# EAGLE design satshakit-mega (EAGLE 8.5.0)

## Sheet 1 of 2
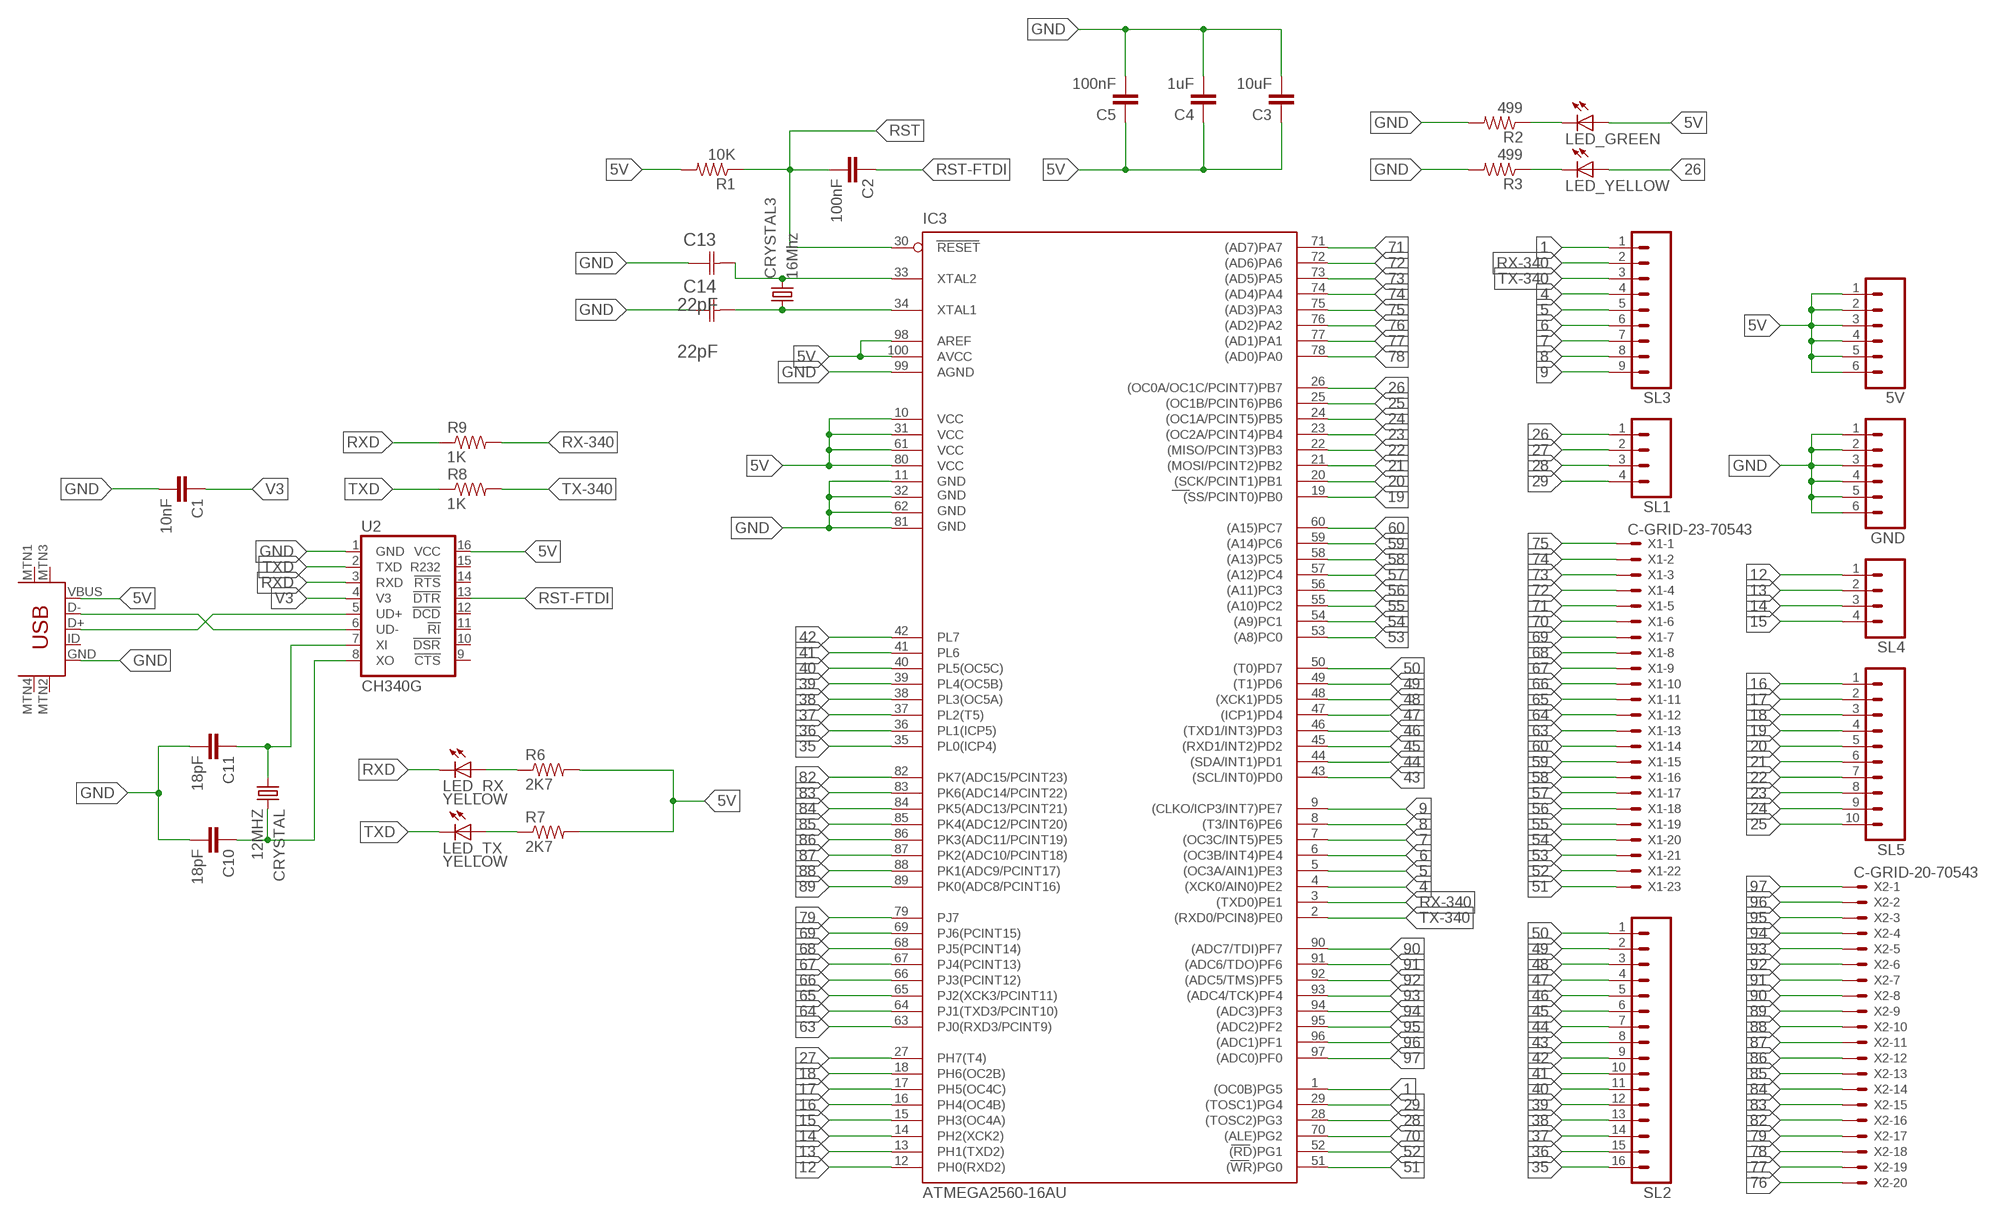
[diagram p0: schematic, sheet 1]

### Parts
5V  M06  [06P]
C1  10nF  CAP1206  [1206]
C2  100nF  CAP1206  [1206]
C3  10uF  CAP1206  [1206]
C4  1uF  CAP1206  [1206]
C5  100nF  CAP1206  [1206]
C10  18pF  CAP1206  [1206]
C11  18pF  CAP1206  [1206]
C13  22pF  0612ZC225MAT2A  [CAPC3216X178N]
C14  22pF  0612ZC225MAT2A  [CAPC3216X178N]
CRYSTAL  12MHZ  CSM-7X-DU  [CSM-7X-DU]
CRYSTAL3  16Mhz  CSM-7X-DU  [CSM-7X-DU]
GND  M06  [06P]
IC3  ATMEGA2560-16AU  ATMEGA1280-16AU  [TQFP100]
LED_GREEN  LED1206  [1206]
LED_RX  YELLOW  LED  [LED1206]
LED_TX  YELLOW  LED  [LED1206]
LED_YELLOW  LED1206  [1206]
R1  10K  RES-US1206  [R1206]
R2  499  RESISTOR1206  [1206]
R3  499  RESISTOR1206  [1206]
R6  2K7  RES-US1206  [R1206]
R7  2K7  RES-US1206  [R1206]
R8  1K  RES-US1206  [R1206]
R9  1K  RES-US1206  [R1206]
SL1  M04  [04P]
SL2  M16  [16P]
SL3  M09  [09P]
SL4  M04  [04P]
SL5  M10  [10P]
U2  CH340G  CH340GSMD  [SO016]
U$7  USB-MINIB-5PIN  [USB-MINIB]
X1  C-GRID-23-70543  [70543-23]
X2  C-GRID-20-70543  [70543-20]

### Nets
1: IC3.1((OC0B)PG5) SL3.1
4: IC3.4((XCK0/AIN0)PE2) SL3.4
5: IC3.5((OC3A/AIN1)PE3) SL3.5
5V: 5V.1 5V.2 5V.3 5V.4 5V.5 5V.6 C3.1 C4.1 C5.1 IC3.10(VCC) IC3.31(VCC1) IC3.61(VCC2) IC3.80(VCC3) IC3.98(AREF) IC3.100(AVCC) LED_GREEN.1(A) R1.2 R6.2 R7.2 U2.16(VCC) U$7.VBUS
6: IC3.6((OC3B/INT4)PE4) SL3.6
7: IC3.7((OC3C/INT5)PE5) SL3.7
8: IC3.8((T3/INT6)PE6) SL3.8
9: IC3.9((CLKO/ICP3/INT7)PE7) SL3.9
12: IC3.12(PH0(RXD2)) SL4.1
13: IC3.13(PH1(TXD2)) SL4.2
14: IC3.14(PH2(XCK2)) SL4.3
15: IC3.15(PH3(OC4A)) SL4.4
16: IC3.16(PH4(OC4B)) SL5.1
17: IC3.17(PH5(OC4C)) SL5.2
18: IC3.18(PH6(OC2B)) SL5.3
19: IC3.19((SS/PCINT0)PB0) SL5.4
20: IC3.20((SCK/PCINT1)PB1) SL5.5
21: IC3.21((MOSI/PCINT2)PB2) SL5.6
22: IC3.22((MISO/PCINT3)PB3) SL5.7
23: IC3.23((OC2A/PCINT4)PB4) SL5.8
24: IC3.24((OC1A/PCINT5)PB5) SL5.9
25: IC3.25((OC1B/PCINT6)PB6) SL5.10
26: IC3.26((OC0A/OC1C/PCINT7)PB7) LED_YELLOW.1(A) SL1.1
27: IC3.27(PH7(T4)) SL1.2
28: IC3.28((TOSC2)PG3) SL1.3
29: IC3.29((TOSC1)PG4) SL1.4
35: IC3.35(PL0(ICP4)) SL2.16
36: IC3.36(PL1(ICP5)) SL2.15
37: IC3.37(PL2(T5)) SL2.14
38: IC3.38(PL3(OC5A)) SL2.13
39: IC3.39(PL4(OC5B)) SL2.12
40: IC3.40(PL5(OC5C)) SL2.11
41: IC3.41(PL6) SL2.10
42: IC3.42(PL7) SL2.9
43: IC3.43((SCL/INT0)PD0) SL2.8
44: IC3.44((SDA/INT1)PD1) SL2.7
45: IC3.45((RXD1/INT2)PD2) SL2.6
46: IC3.46((TXD1/INT3)PD3) SL2.5
47: IC3.47((ICP1)PD4) SL2.4
48: IC3.48((XCK1)PD5) SL2.3
49: IC3.49((T1)PD6) SL2.2
50: IC3.50((T0)PD7) SL2.1
51: IC3.51((WR)PG0) X1.23
52: IC3.52((RD)PG1) X1.22
53: IC3.53((A8)PC0) X1.21
54: IC3.54((A9)PC1) X1.20
55: IC3.55((A10)PC2) X1.19
56: IC3.56((A11)PC3) X1.18
57: IC3.57((A12)PC4) X1.17
58: IC3.58((A13)PC5) X1.16
59: IC3.59((A14)PC6) X1.15
60: IC3.60((A15)PC7) X1.14
63: IC3.63(PJ0(RXD3/PCINT9)) X1.13
64: IC3.64(PJ1(TXD3/PCINT10)) X1.12
65: IC3.65(PJ2(XCK3/PCINT11)) X1.11
66: IC3.66(PJ3(PCINT12)) X1.10
67: IC3.67(PJ4(PCINT13)) X1.9
68: IC3.68(PJ5(PCINT14)) X1.8
69: IC3.69(PJ6(PCINT15)) X1.7
70: IC3.70((ALE)PG2) X1.6
71: IC3.71((AD7)PA7) X1.5
72: IC3.72((AD6)PA6) X1.4
73: IC3.73((AD5)PA5) X1.3
74: IC3.74((AD4)PA4) X1.2
75: IC3.75((AD3)PA3) X1.1
76: IC3.76((AD2)PA2) X2.20
77: IC3.77((AD1)PA1) X2.19
78: IC3.78((AD0)PA0) X2.18
79: IC3.79(PJ7) X2.17
82: IC3.82(PK7(ADC15/PCINT23)) X2.16
83: IC3.83(PK6(ADC14/PCINT22)) X2.15
84: IC3.84(PK5(ADC13/PCINT21)) X2.14
85: IC3.85(PK4(ADC12/PCINT20)) X2.13
86: IC3.86(PK3(ADC11/PCINT19)) X2.12
87: IC3.87(PK2(ADC10/PCINT18)) X2.11
88: IC3.88(PK1(ADC9/PCINT17)) X2.10
89: IC3.89(PK0(ADC8/PCINT16)) X2.9
90: IC3.90((ADC7/TDI)PF7) X2.8
91: IC3.91((ADC6/TDO)PF6) X2.7
92: IC3.92((ADC5/TMS)PF5) X2.6
93: IC3.93((ADC4/TCK)PF4) X2.5
94: IC3.94((ADC3)PF3) X2.4
95: IC3.95((ADC2)PF2) X2.3
96: IC3.96((ADC1)PF1) X2.2
97: IC3.97((ADC0)PF0) X2.1
GND: C1.2 C3.2 C4.2 C5.2 C10.2 C11.2 C13.1(C1) C14.1(C1) GND.1 GND.2 GND.3 GND.4 GND.5 GND.6 IC3.11(GND) IC3.32(GND1) IC3.62(GND2) IC3.81(GND3) IC3.99(AGND) R2.2 R3.2 U2.1(GND) U$7.GND
N$1: U2.5(UD+) U$7.D+
N$2: LED_RX.1(A) R6.1
N$3: U2.6(UD-) U$7.D-
N$4: C14.2(C2) CRYSTAL3.1 IC3.34(XTAL1)
N$5: C13.2(C2) CRYSTAL3.2 IC3.33(XTAL2)
N$6: LED_YELLOW.2(C) R3.1
N$8: LED_TX.1(A) R7.1
N$26: LED_GREEN.2(C) R2.1
OSC_IN: C10.1 CRYSTAL.2 U2.8(XO)
OSC_OUT: C11.1 CRYSTAL.1 U2.7(XI)
RST: C2.2 IC3.30(RESET) R1.1
RST-FTDI: C2.1 U2.13(!DTR)
RX-340: IC3.3((TXD0)PE1) R9.2 SL3.2
RXD: LED_RX.2(C) R9.1 U2.3(RXD)
TX-340: IC3.2((RXD0/PCIN8)PE0) R8.2 SL3.3
TXD: LED_TX.2(C) R8.1 U2.2(TXD)
V3: C1.1 U2.4(V3)
Unconnected: U2.9(!CTS) U2.10(!DSR) U2.11(!RI) U2.12(!DCD) U2.14(!RTS) U2.15(R232) U$7.ID U$7.MTN1(MTN2) U$7.MTN2(MTN3) U$7.MTN3(MTN1) U$7.MTN4

## Sheet 2 of 2

## Library data of the parts
5V GND = con-amp-quick:M06: AMP QUICK CONNECTOR; OC_FARNELL: unknown; OC_NEWARK: unknown
C1-C5 C10 C11 = 01_SparkFun:CAP: Capacitor Standard 0603 ceramic capacitor, and 0.1" leaded capacitor.
C13 C14 = AVX_By_element14_Batch_1:0612ZC225MAT2A: Capacitor 1206; MPN: 0612ZC225MAT2A; OC_FARNELL: -; OC_NEWARK: 12N3209; SUPPLIER: AVX; TOLERANCE: ±20%; VALUE: 2.2µF; VOLTAGERATING: 10V
CRYSTAL = flight_controller.lbr01_FAB_Hello:CSM-7X-DU: SMD CRYSTAL Source: www.ecsxtal.com .. Crystal 3.6864MHz CSM_7X_DU.PDF; OC_FARNELL: unknown; OC_NEWARK: unknown
CRYSTAL3 = 01_FAB_Hello:CSM-7X-DU: SMD CRYSTAL Source: www.ecsxtal.com .. Crystal 3.6864MHz CSM_7X_DU.PDF; OC_FARNELL: unknown; OC_NEWARK: unknown
IC3 = atmel-2005:ATMEGA*: MICROCONTROLLER 64/128/256 Kbytes FLASH 4 Kbytes EEPROM 8 Kbytes SRAM 86 General Purpose I/O pins 12-channels16-bit PWM 4 x Serial USARTs 16-channels 10-bit A/D
LED_GREEN LED_YELLOW = 01_FAB_Hello:LED
LED_RX LED_TX = fab:LED: LED
R1 R6-R9 = fab:RES-US: Resistor (US Symbol) Variants with postfix FAB are widened to allow the routing of internal traces
R2 R3 = 01_SparkFun:RESISTOR: Resistor Basic schematic elements and footprints for 0603, 1206, and PTH 1/10th watt (small) resistors.
SL1 SL4 = con-amp-quick:M04: AMP QUICK CONNECTOR; OC_FARNELL: unknown; OC_NEWARK: unknown
SL2 = con-amp-quick:M16: AMP QUICK CONNECTOR; OC_FARNELL: unknown; OC_NEWARK: unknown
SL3 = con-amp-quick:M09: AMP QUICK CONNECTOR; OC_FARNELL: unknown; OC_NEWARK: unknown
SL5 = con-amp-quick:M10: AMP QUICK CONNECTOR; OC_FARNELL: unknown; OC_NEWARK: unknown
U2 = SparkFun-DigitalIC:CH340G: A simple USB 2.0 to Serial IC.; PROD_ID: IC-13498
U$7 = SparkFun:USB-MINIB
X1 = con-molex:C-GRID-23: CONNECTOR wire to board 2.54 mm (0.100") pitch header; OC_FARNELL: unknown; OC_NEWARK: unknown
X2 = con-molex:C-GRID-20: CONNECTOR wire to board 2.54 mm (0.100") pitch header; OC_FARNELL: unknown; OC_NEWARK: unknown

## Board
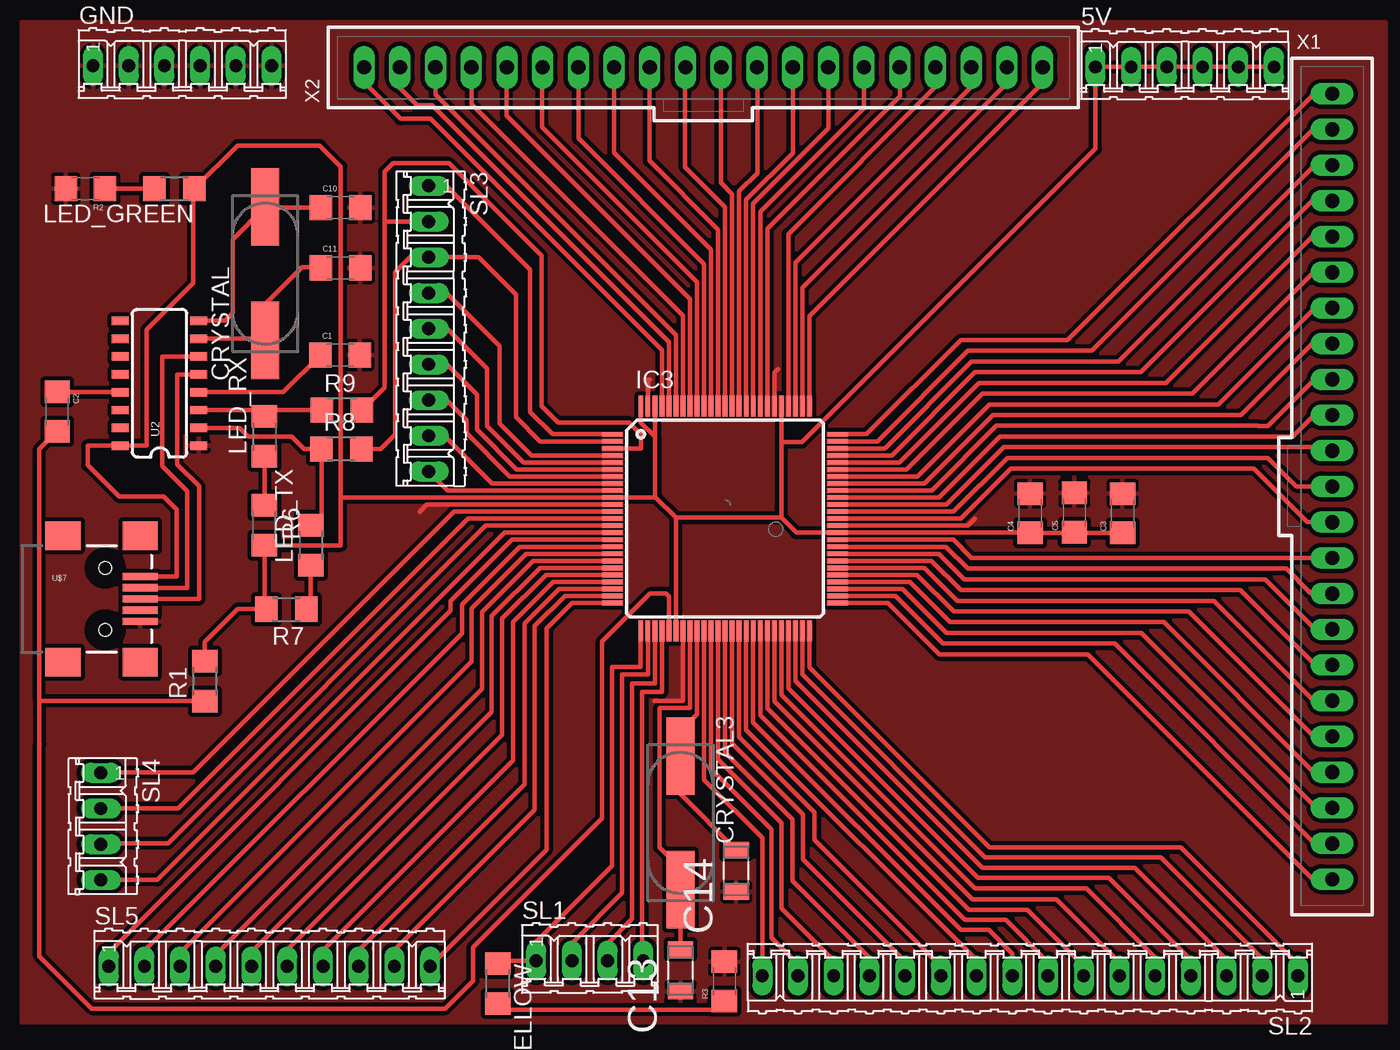
[diagram p1: board, top side]

No outline drawn. Coordinates in mm, seen from the top.
Copper layers (1*16): Top 0.035mm / dielectric 1.5mm / Bottom 0.035mm
Design rules "default": minimum track width 10mil, minimum drill 24mil, track to track 8mil, track to pad 8mil, pad to pad 8mil, via to via 8mil, smd to smd 8mil, copper to edge 40mil, drill to drill 8mil, minimum pad ring 10mil, minimum via ring 8mil, stop-mask expansion 4mil, vias tented up to drill 0mil, thermal gap 10mil

### Footprints (pad centres in the part's own frame; a part is rotated, then mirrored left to right if it is on the bottom)
06P = drill 0.914 long: 1 -6.35,0; 2 -3.81,0; 3 -1.27,0; 4 1.27,0; 5 3.81,0; 6 6.35,0
1206 = smd 1.6 x 1.8: 1 -1.4,0; 2 1.4,0
CAPC3216X178N = smd 1.118 x 1.803: 1 -1.499,0; 2 1.499,0
CSM-7X-DU = smd 5.5 x 2: 1 -4.75,0; 2 4.75,0
TQFP100 = smd 1.5 x 0.35: 1 -8,6; 2 -8,5.5; 3 -8,5; 4 -8,4.5; 5 -8,4; 6 -8,3.5; 7 -8,3; 8 -8,2.5; 9 -8,2; 10 -8,1.5; 11 -8,1; 12 -8,0.5; 13 -8,0; 14 -8,-0.5; 15 -8,-1; 16 -8,-1.5; 17 -8,-2; 18 -8,-2.5; 19 -8,-3; 20 -8,-3.5; 21 -8,-4; 22 -8,-4.5; 23 -8,-5; 24 -8,-5.5; 25 -8,-6; 51 8,-6; 52 8,-5.5; 53 8,-5; 54 8,-4.5; 55 8,-4; 56 8,-3.5; 57 8,-3; 58 8,-2.5; 59 8,-2; 60 8,-1.5; 61 8,-1; 62 8,-0.5; 63 8,0; 64 8,0.5; 65 8,1; 66 8,1.5; 67 8,2; 68 8,2.5; 69 8,3; 70 8,3.5; 71 8,4; 72 8,4.5; 73 8,5; 74 8,5.5; 75 8,6 | smd 0.35 x 1.5: 26 -6,-8; 27 -5.5,-8; 28 -5,-8; 29 -4.5,-8; 30 -4,-8; 31 -3.5,-8; 32 -3,-8; 33 -2.5,-8; 34 -2,-8; 35 -1.5,-8; 36 -1,-8; 37 -0.5,-8; 38 0,-8; 39 0.5,-8; 40 1,-8; 41 1.5,-8; 42 2,-8; 43 2.5,-8; 44 3,-8; 45 3.5,-8; 46 4,-8; 47 4.5,-8; 48 5,-8; 49 5.5,-8; 50 6,-8; 76 6,8; 77 5.5,8; 78 5,8; 79 4.5,8; 80 4,8; 81 3.5,8; 82 3,8; 83 2.5,8; 84 2,8; 85 1.5,8; 86 1,8; 87 0.5,8; 88 0,8; 89 -0.5,8; 90 -1,8; 91 -1.5,8; 92 -2,8; 93 -2.5,8; 94 -3,8; 95 -3.5,8; 96 -4,8; 97 -4.5,8; 98 -5,8; 99 -5.5,8; 100 -6,8
1206' = smd 1.6 x 1.803: 1 -1.422,0; 2 1.422,0
LED1206 = smd 1.6 x 1.803: 1 -1.422,0; 2 1.422,0
R1206 = smd 1.6 x 1.803: 1 -1.422,0; 2 1.422,0
04P = drill 0.914 long: 1 -3.81,0; 2 -1.27,0; 3 1.27,0; 4 3.81,0
16P = drill 0.914 long: 1 -19.05,0; 2 -16.51,0; 3 -13.97,0; 4 -11.43,0; 5 -8.89,0; 6 -6.35,0; 7 -3.81,0; 8 -1.27,0; 9 1.27,0; 10 3.81,0; 11 6.35,0; 12 8.89,0; 13 11.43,0; 14 13.97,0; 15 16.51,0; 16 19.05,0
09P = drill 0.914 long: 1 -10.16,0; 2 -7.62,0; 3 -5.08,0; 4 -2.54,0; 5 0,0; 6 2.54,0; 7 5.08,0; 8 7.62,0; 9 10.16,0
10P = drill 0.914 long: 1 -11.43,0; 2 -8.89,0; 3 -6.35,0; 4 -3.81,0; 5 -1.27,0; 6 1.27,0; 7 3.81,0; 8 6.35,0; 9 8.89,0; 10 11.43,0
SO016 = smd 0.6 x 1.2: 1 -4.445,-2.8; 2 -3.175,-2.8; 3 -1.905,-2.8; 4 -0.635,-2.8; 5 0.635,-2.8; 6 1.905,-2.8; 7 3.175,-2.8; 8 4.445,-2.8; 9 4.445,2.8; 10 3.175,2.8; 11 1.905,2.8; 12 0.635,2.8; 13 -0.635,2.8; 14 -1.905,2.8; 15 -3.175,2.8; 16 -4.445,2.8
USB-MINIB = smd 2.5 x 0.5: D+ 2.5,0; D- 2.5,0.8; GND 2.5,-1.6; ID 2.5,-0.8; VBUS 2.5,1.6 | smd 2.5 x 2: MTN1 -3,4.5; MTN2 2.5,4.5; MTN3 -3,-4.5; MTN4 2.5,-4.5 | hole 0.9: 0,2.2; 0,-2.2
70543-23 = drill 1.016 long: 1 -27.94,0; 2 -25.4,0; 3 -22.86,0; 4 -20.32,0; 5 -17.78,0; 6 -15.24,0; 7 -12.7,0; 8 -10.16,0; 9 -7.62,0; 10 -5.08,0; 11 -2.54,0; 12 0,0; 13 2.54,0; 14 5.08,0; 15 7.62,0; 16 10.16,0; 17 12.7,0; 18 15.24,0; 19 17.78,0; 20 20.32,0; 21 22.86,0; 22 25.4,0; 23 27.94,0
70543-20 = drill 1.016 long: 1 -24.13,0; 2 -21.59,0; 3 -19.05,0; 4 -16.51,0; 5 -13.97,0; 6 -11.43,0; 7 -8.89,0; 8 -6.35,0; 9 -3.81,0; 10 -1.27,0; 11 1.27,0; 12 3.81,0; 13 6.35,0; 14 8.89,0; 15 11.43,0; 16 13.97,0; 17 16.51,0; 18 19.05,0; 19 21.59,0; 20 24.13,0

### Placement (x,y rotation side)
5V  108.89,90.81 0 top
C1  48.82,70.31 0 top
C2  28.7,66.29 270 top
C3  104.47,59.05 90 top
C4  97.89,59.05 90 top
C5  101.04,59.11 90 top
C10  48.84,80.8 0 top
C11  48.84,76.5 0 top
C13  73.03,26.54 90 top
C14  76.99,33.63 90 top
CRYSTAL  43.48,76.1 90 top
CRYSTAL3  73.03,37.03 270 top
GND  37.59,90.88 0 top
IC3  76.2,58.67 0 top
LED_GREEN  [1206']  37.03,82.14 180 top
LED_RX  43.43,64.52 90 top
LED_TX  46.74,56.79 90 top
LED_YELLOW  [1206']  60.05,25.6 270 top
R1  39.19,47.12 90 top
R2  30.71,82.14 180 top
R3  76.15,25.76 90 top
R6  43.43,58.19 270 top
R7  44.98,52.22 180 top
R8  48.92,63.63 0 top
R9  48.95,66.4 0 top
SL1  66.57,27.23 0 top
SL2  97.89,26.16 180 top
SL3  55.12,72.19 270 top
SL4  31.8,36.78 270 top
SL5  43.79,26.82 0 top
U2  35.97,68.3 90 top
U$7  32.11,52.96 0 top
X1  119.38,60.96 270 top
X2  74.65,90.78 0 top

### Tracks (layer width: path | path; a pad name or v marks a point on that pad's centre or on a via)
1
  Top 0.305: IC3.1 63.93,64.67 62.33,66.27 62.33,76.38 56.36,82.35 SL3.1
4
  Top 0.305: IC3.4 62.43,63.17 60.17,65.43 60.17,70.94 56.39,74.73 SL3.4
5
  Top 0.305: IC3.5 61.86,62.67 59.28,65.25 59.28,69.34 56.44,72.19 SL3.5
5V
  Top 0.305: 80.2,58.74 80.2,64.11 | 80.2,64.11 IC3.80 | 80.2,58.74 81.26,57.67 IC3.61 97.87,57.67 C4.1 100.99,57.66 C5.1 101.09,57.66 C3.1 | IC3.31 72.7,58.74 | 72.7,58.74 80.2,58.74 | 71.12,60.17 IC3.10 | 71.12,60.17 71.26,60.17 72.7,58.74 | 71.2,64.52 IC3.98 | 71.2,64.52 71.2,60.25 71.12,60.17 | IC3.10 68.18,60.2 | 43.43,52.35 R6.2 48.87,56.77 48.87,60.17 | 43.43,52.35 R7.2 | 43.43,52.35 43.33,52.25 41.53,52.25 39.19,49.91 R1.2 | IC3.10 48.87,60.17 | U$7.VBUS 37.21,54.56 37.21,59.31 36.27,60.25 33.1,60.25 30.86,62.48 30.86,63.86 U2.16 35.08,63.86 35.08,72.11 38.38,75.41 38.38,82.07 LED_GREEN.1 | IC3.100 70.2,65.52 71.2,64.52 | LED_GREEN.1 41.53,85.22 47.37,85.22 48.87,83.72 48.87,60.17 | 38.45,81.61 LED_GREEN.1 | 80.2,64.11 81.66,64.11 102.54,84.99 5V.1 5V.2 5V.3 5V.4 5V.5 5V.6
6
  Top 0.305: IC3.6 61.37,62.17 58.55,65 58.55,67.51 56.39,69.67 55.14,69.67 SL3.6
7
  Top 0.305: IC3.7 60.88,61.67 57.81,64.75 57.81,65.68 56.41,67.08 55.14,67.08 SL3.7
8
  Top 0.305: IC3.8 59.63,61.17 56.31,64.49 55.19,64.49 SL3.8
9
  Top 0.305: IC3.9 56.47,60.67 SL3.9
12
  Top 0.305: IC3.12 56.94,59.17 38.38,40.62 31.83,40.62 SL4.1
13
  Top 0.305: IC3.13 57.91,58.67 37.29,38.05 SL4.2
14
  Top 0.305: IC3.14 59.16,58.17 36.58,35.59 31.88,35.59 SL4.3
15
  Top 0.305: IC3.15 60.52,57.67 35.81,32.97 SL4.4
16
  Top 0.305: IC3.16 61.06,57.17 56.69,52.81 56.69,52.15 32.38,27.84 32.38,26.85 SL5.1
17
  Top 0.305: IC3.17 61.58,56.67 57.48,52.58 57.48,50.52 34.9,27.94 SL5.2
18
  Top 0.305: IC3.18 62.04,56.17 58.17,52.3 58.17,48.51 37.47,27.81 37.47,26.85 SL5.3
19
  Top 0.305: IC3.19 62.56,55.67 58.9,52.02 58.9,46.56 39.98,27.64 SL5.4
20
  Top 0.305: IC3.20 63.02,55.17 59.59,51.74 59.59,44.93 42.55,27.89 42.55,26.85 SL5.5
21
  Top 0.305: IC3.21 63.46,54.67 60.35,51.56 60.35,43.31 45.06,28.02 SL5.6
22
  Top 0.305: IC3.22 63.98,54.17 61.11,51.31 61.11,41.48 47.57,27.94 47.57,26.85 SL5.7
23
  Top 0.305: IC3.23 64.39,53.67 61.92,51.21 61.92,39.78 50.16,28.02 50.16,26.85 SL5.8
24
  Top 0.305: IC3.24 64.81,53.17 62.66,51.03 62.66,37.95 52.7,27.99 52.7,26.85 SL5.9
25
  Top 0.305: IC3.25 65.32,52.67 63.5,50.85 63.5,35.1 SL5.10
26
  Top 0.305: IC3.26 70.2,48.11 68.17,48.11 68.17,33.98 62.76,28.57 SL1.1 60.25,27.23 LED_YELLOW.1
27
  Top 0.305: IC3.27 70.7,47.6 68.89,47.6 68.89,32.05 65.3,28.47 SL1.2
28
  Top 0.305: IC3.28 71.2,46.94 69.6,46.94 69.6,30.2 67.84,28.45 SL1.3
29
  Top 0.305: IC3.29 71.7,46.33 70.31,46.33 70.31,27.23 SL1.4
35
  Top 0.305: IC3.35 74.7,40.11 78.84,35.97 SL2.16
36
  Top 0.305: IC3.36 75.2,40.88 79.5,36.58 79.5,28.85 81.38,26.98 SL2.15
37
  Top 0.305: IC3.37 75.7,41.55 80.21,37.03 80.21,30.94 83.97,27.18 83.97,26.21 SL2.14
38
  Top 0.305: IC3.38 76.2,42.06 80.97,37.29 80.97,32.92 86.46,27.43 SL2.13
39
  Top 0.305: IC3.39 76.7,42.68 81.74,37.64 81.74,34.44 89,27.18 SL2.12
40
  Top 0.305: IC3.40 77.2,43.15 82.55,37.8 82.55,35.81 91.54,26.82 SL2.11
41
  Top 0.305: IC3.41 77.7,43.66 94.08,27.28 SL2.10
42
  Top 0.305: IC3.42 78.2,44.18 92.96,29.41 94.94,29.41 96.62,27.74 SL2.9
43
  Top 0.305: IC3.43 78.7,44.69 93.27,30.12 96.16,30.12 99.16,27.13 SL2.8
44
  Top 0.305: IC3.44 79.2,45.16 93.52,30.84 97.69,30.84 101.7,26.82 SL2.7
45
  Top 0.305: IC3.45 79.7,45.67 93.78,31.6 99.77,31.6 104.24,27.13 SL2.6
46
  Top 0.305: IC3.46 80.2,46.14 93.98,32.36 101.91,32.36 106.78,27.48 SL2.5
47
  Top 0.305: IC3.47 80.7,46.6 94.18,33.12 103.48,33.12 109.32,27.28 SL2.4
48
  Top 0.305: IC3.48 81.2,47.12 94.49,33.83 105.36,33.83 111.86,27.33 SL2.3
49
  Top 0.305: IC3.49 81.7,47.59 94.69,34.59 107.19,34.59 114.4,27.38 SL2.2
50
  Top 0.305: IC3.50 82.2,48.1 95,35.31 108.61,35.31 116.94,26.98 SL2.1
51
  Top 0.305: IC3.51 87.79,52.67 91.44,49.02 102.01,49.02 118.01,33.02 X1.23
52
  Top 0.305: IC3.52 88.3,53.17 91.69,49.78 103.91,49.78 118.11,35.59 119.36,35.59 X1.22
53
  Top 0.305: IC3.53 88.82,53.67 91.95,50.55 105.82,50.55 118.26,38.1 X1.21
54
  Top 0.305: IC3.54 89.34,54.17 92.2,51.31 107.42,51.31 118.08,40.64 X1.20
55
  Top 0.305: IC3.55 89.85,54.67 92.46,52.07 109.19,52.07 118.03,43.23 119.33,43.23 X1.19
56
  Top 0.305: IC3.56 90.37,55.17 92.71,52.83 110.95,52.83 118.08,45.7 119.36,45.7 X1.18
57
  Top 0.305: IC3.57 90.88,55.67 92.96,53.59 112.85,53.59 118.19,48.26 X1.17
58
  Top 0.305: IC3.58 91.4,56.17 93.22,54.36 114.61,54.36 118.14,50.83 119.36,50.83 X1.16
59
  Top 0.305: IC3.59 91.92,56.67 93.47,55.12 116.1,55.12 117.83,53.39 119.33,53.39 X1.15
60
  Top 0.305: IC3.60 92.43,57.17 93.73,55.88 X1.14
63
  Top 0.305: IC3.63 92.96,58.67 96.52,62.23 113.79,62.23 117.6,58.42 X1.13
64
  Top 0.305: IC3.64 92.45,59.17 96.27,62.99 114.81,62.99 116.84,60.96 X1.12
65
  Top 0.305: IC3.65 91.93,59.67 96.01,63.75 119.13,63.75 X1.11
66
  Top 0.305: IC3.66 91.42,60.17 95.76,64.52 116.59,64.52 118.11,66.04 X1.10
67
  Top 0.305: IC3.67 90.9,60.67 95.5,65.28 114.05,65.28 114.07,65.25 114.78,65.25 118.11,68.58 X1.9
68
  Top 0.305: IC3.68 90.38,61.17 95.25,66.04 112.88,66.04 117.98,71.14 119.36,71.14 X1.8
69
  Top 0.305: IC3.69 89.87,61.67 95,66.8 111.28,66.8 118.14,73.66 X1.7
70
  Top 0.305: IC3.70 89.1,62.17 94.49,67.56 109.42,67.56 118.06,76.2 X1.6
71
  Top 0.305: IC3.71 88.58,62.67 94.23,68.33 107.54,68.33 117.96,78.74 X1.5
72
  Top 0.305: IC3.72 88.07,63.17 93.98,69.09 105.77,69.09 117.93,81.25 119.36,81.25 X1.4
73
  Top 0.305: IC3.73 87.55,63.67 93.73,69.85 104.17,69.85 118.14,83.82 X1.3
74
  Top 0.305: IC3.74 87.03,64.17 93.47,70.61 102.29,70.61 118.01,86.33 119.36,86.33 X1.2
75
  Top 0.305: IC3.75 86.26,64.67 92.96,71.37 100.56,71.37 118.06,88.88 119.36,88.88 X1.1
76
  Top 0.305: IC3.76 82.2,73.08 98.81,89.69 98.81,90.75 X2.20
77
  Top 0.305: IC3.77 81.7,75.12 96.24,89.66 X2.19
78
  Top 0.305: IC3.78 81.2,76.88 93.73,89.41 93.73,90.75 X2.18
79
  Top 0.305: IC3.79 80.7,78.92 91.16,89.38 X2.17
82
  Top 0.305: IC3.82 79.2,79.3 88.62,88.72 X2.16
83
  Top 0.305: IC3.83 78.7,80.5 86.08,87.88 X2.15
84
  Top 0.305: IC3.84 78.2,81.07 83.57,86.44 83.57,90.75 X2.14
85
  Top 0.305: IC3.85 77.7,81.36 81.03,84.68 81.03,90.75 X2.13
86
  Top 0.305: IC3.86 77.2,81.97 78.49,83.26 78.49,90.75 X2.12
87
  Top 0.305: IC3.87 76.7,81.77 75.89,82.58 75.89,90.75 X2.11
88
  Top 0.305: IC3.88 76.2,80.82 73.36,83.67 73.36,90.75 X2.10
89
  Top 0.305: IC3.89 75.7,79.24 70.81,84.12 70.81,90.75 X2.9
90
  Top 0.305: IC3.90 75.2,77.81 68.3,84.71 X2.8
91
  Top 0.305: IC3.91 74.7,76.79 65.76,85.72 X2.7
92
  Top 0.305: IC3.92 74.2,75.51 63.2,86.51 63.2,90.75 X2.6
93
  Top 0.305: IC3.93 73.7,74.28 60.66,87.33 60.66,90.75 X2.5
94
  Top 0.305: IC3.94 73.2,73.1 58.17,88.14 58.17,90.75 X2.4
95
  Top 0.305: IC3.95 72.7,71.72 55.6,88.82 X2.3
96
  Top 0.305: IC3.96 72.2,71.23 55.35,88.09 54.3,88.09 53.06,89.33 53.06,89.81 | 53.06,89.81 53.06,89.31 | 53.06,89.81 X2.2
97
  Top 0.305: IC3.97 71.7,70.67 55.24,87.12 53.11,87.12 50.52,89.71 50.52,90.35 | 50.52,90.35 50.52,89.69 | 50.52,90.35 X2.1
GND
  Top 0.305: IC3.99 70.7,68.58 70.87,68.58 | 93.98,58.67 93.48,58.17 IC3.62 | 71.17,45.72 73.2,45.72 IC3.32 | 54.46,59.16 54.98,59.67 IC3.11 | IC3.81 79.7,69.06 79.96,69.32
  pour Top (isolate 0.305): 26.16,93.98 26.16,22.86 123.19,22.86 123.19,93.98
N$1
  Top 0.305: U$7.D+ 38.79,52.96 38.79,60.98 37.24,62.53 37.24,68.94 U2.5
N$2
  Top 0.305: LED_RX.1 R6.1
N$3
  Top 0.305: U$7.D- 37.95,53.76 37.95,60.63 36.17,62.41 36.17,70.21 U2.6
N$4
  Top 0.305: IC3.34 74.2,44.74 73.05,43.59 73.05,41.81 CRYSTAL3.1 73.03,39.09 C14.2
N$5
  Top 0.305: IC3.33 73.7,45.21 71.58,45.21 71.53,45.16 71.53,35.31 73.03,33.81 CRYSTAL3.2 | 73,33.88 73,32.31 CRYSTAL3.2 | CRYSTAL3.2 C13.2
N$6
  Top 0.305: 60.43,23.8 LED_YELLOW.2 60.48,23.75 75.56,23.75 75.56,23.77 R3.1
N$8
  Top 0.305: LED_TX.1 46.74,52.55 R7.1
N$26
  Top 0.305: R2.1 LED_GREEN.2
OSC_IN
  Top 0.305: U2.8 40.64,72.75 41.17,73.28 41.17,78.54 CRYSTAL.2 43.48,80.8 C10.1
OSC_OUT
  Top 0.305: U2.7 43.48,71.48 CRYSTAL.1 43.48,73.94 46.1,76.56 47.39,76.56 C11.1
RST
  Top 0.305: IC3.30 72.2,53.15 72.01,53.34 70.87,53.34 67.46,49.94 67.46,37.36 58.27,28.17 58.27,25.81 56.29,23.82 31.17,23.82 27.43,27.56 27.43,42.62 | 27.46,42.65 27.43,42.62 | 27.43,45.8 27.43,42.62 | 27.43,45.8 27.43,63.62 C2.2 | R1.1 27.53,45.7 27.43,45.8
RST-FTDI
  Top 0.305: C2.1 33.14,67.69 U2.13
RX-340
  Top 0.305: R9.2 51.97,68 51.97,79.78 | 55.09,79.83 SL3.2 51.99,79.81 51.97,79.78 | 51.97,79.78 51.97,83.34 52.58,83.95 56.57,83.95 63.14,77.37 63.14,66.67 64.31,65.51 69.37,65.51 70.21,64.67 70.21,63.67 IC3.3
RXD
  Top 0.305: 44.07,66.4 U2.3 | 44.07,66.4 R9.1 | LED_RX.2 44.02,66.34 44.07,66.4
TX-340
  Top 0.305: R8.2 51.71,63.63 52.73,64.64 52.73,76.2 53.8,77.27 SL3.3 55.17,77.32 55.8,77.32 55.85,77.27 58.65,77.27 61.32,74.6 61.32,65.89 63.03,64.17 IC3.2
TXD
  Top 0.305: 46.79,63.65 47.47,63.65 R8.1 | R8.1 46.25,63.63 45.36,64.52 42.27,64.52 41.66,65.13 U2.2 | R8.1 47.5,58.98 LED_TX.2
V3
  Top 0.305: U2.4 44.78,67.67 C1.1